# EAGLE design controlboard (EAGLE 9.2.2)
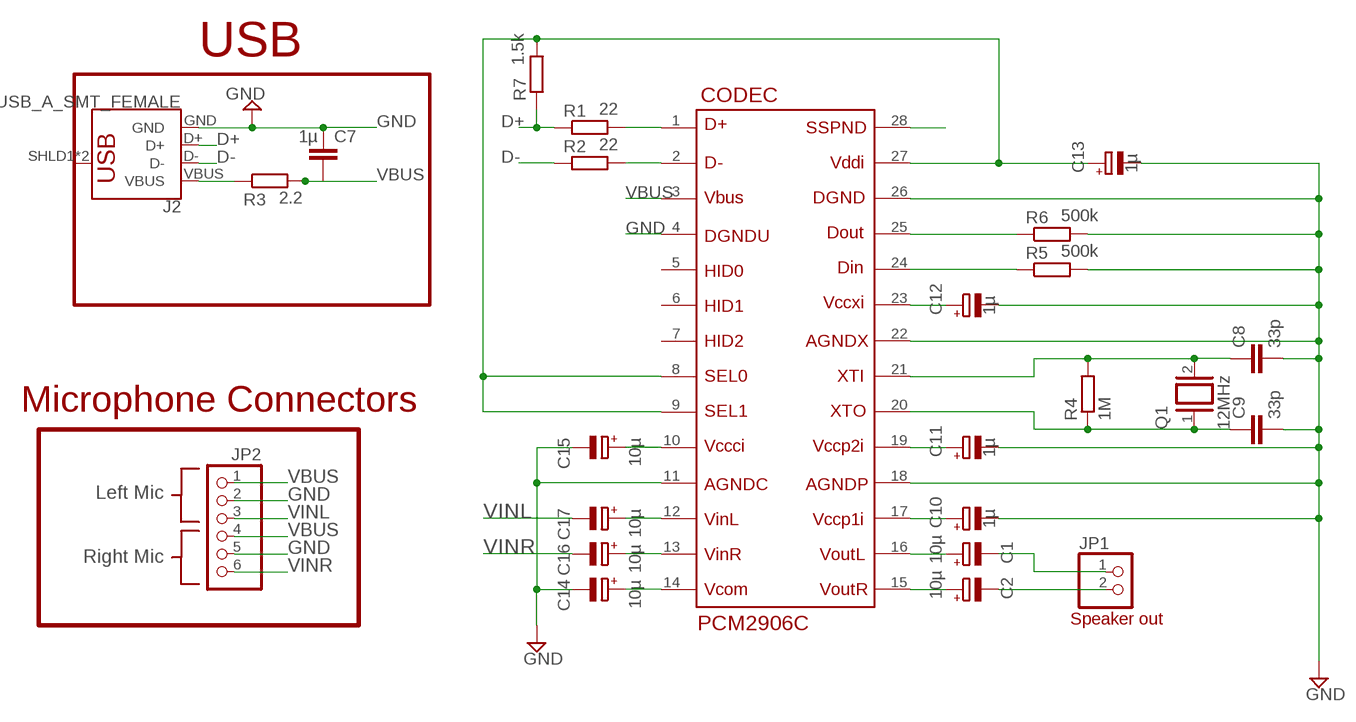
[diagram p0: schematic, sheet 1]

## Parts
C1  10µ  CPOL-EU153CLV-0807  [153CLV-0807]
C2  10µ  CPOL-EU153CLV-0807  [153CLV-0807]
C7  1µ  C-EUC0805  [C0805]
C8  33p  C-EUC0805  [C0805]
C9  33p  C-EUC0805  [C0805]
C10  1µ  CPOL-EU153CLV-0807  [153CLV-0807]
C11  1µ  CPOL-EU153CLV-0807  [153CLV-0807]
C12  1µ  CPOL-EU153CLV-0807  [153CLV-0807]
C13  1µ  CPOL-EU153CLV-0807  [153CLV-0807]
C14  10µ  CPOL-EU153CLV-0807  [153CLV-0807]
C15  10µ  CPOL-EU153CLV-0807  [153CLV-0807]
C16  10µ  CPOL-EU153CLV-0807  [153CLV-0807]
C17  10µ  CPOL-EU153CLV-0807  [153CLV-0807]
CODEC  PCM2906C  [SOP65P780X200-28N]
J2  USB_A_SMT_FEMALE  [USB-A-S-SILK-FEMALE]
JP1  PINHD-1X2  [1X02]
JP2  PINHD-1X6  [1X06]
Q1  12MHz  XTAL/S  [QS]
R1  22  R-EU_R0805  [R0805]
R2  22  R-EU_R0805  [R0805]
R3  2.2  R-EU_R0805  [R0805]
R4  1M  R-EU_R0805  [R0805]
R5  500k  R-EU_R0805  [R0805]
R6  500k  R-EU_R0805  [R0805]
R7  1.5k  R-EU_R0805  [R0805]

## Nets
D+: J2.D+ R1.1 R7.1
D-: J2.D- R2.1
GND: C7.1 C8.2 C9.2 C10.- C11.- C12.- C13.- C14.- C15.- CODEC.4 CODEC.11 CODEC.18 CODEC.22 CODEC.26 J2.GND JP2.2 JP2.5 R5.2 R6.2
N$1: CODEC.1 R1.2
N$2: CODEC.2 R2.2
N$3: J2.VBUS R3.1
N$4: C11.+ CODEC.19
N$5: C9.1 CODEC.20 Q1.1 R4.1
N$6: C8.1 CODEC.21 Q1.2 R4.2
N$7: C10.+ CODEC.17
N$8: C12.+ CODEC.23
N$9: CODEC.25 R6.1
N$10: CODEC.24 R5.1
N$11: C13.+ CODEC.8 CODEC.9 CODEC.27 R7.2
N$12: C15.+ CODEC.10
N$13: C14.+ CODEC.14
N$14: CODEC.28
N$15: C1.+ CODEC.16
N$16: C2.+ CODEC.15
N$17: C17.+ CODEC.12
N$18: C16.+ CODEC.13
N$19: C1.- JP1.1
N$20: C2.- JP1.2
VBUS: C7.2 CODEC.3 JP2.1 JP2.4 R3.2
VINL: C17.- JP2.3
VINR: C16.- JP2.6
Unconnected: CODEC.5 CODEC.6 CODEC.7 J2.SHLD1(SHIELD) J2.SHLD2(SHIELD)

## Notes on the sheet
- USB
- Microphone Connectors
- Left Mic
- Right Mic
- Speaker out

## Library data of the parts
C1 C2 C10-C17 = resistor:CPOL-EU: POLARIZED CAPACITOR, European symbol
C7-C9 = rcl:C-EU: CAPACITOR, European symbol; SPICEPREFIX: C
CODEC = PCM2906C_custom:PCM2906C
J2 = SparkFun-Connectors:USB_A: USB-A Connector Male and female variants, as well as PTH and SMT variants SparkFun Products: SparkFun XBee Explorer Dongle <https://www.sparkfun.com/products/11697> PTH Male SparkFun MicroView-USB Programmer <https://www.sparkfun.com/products/12924> SMT Male SparkFun USB Type A Female Breakout <https://www.sparkfun.com/products/12700> SMT Female; PROD_ID: CONN-09520; SF_ID: PRT-09011
JP1 = pinhead:PINHD-1X2: PIN HEADER
JP2 = pinhead:PINHD-1X6: PIN HEADER
Q1 = special:XTAL/S: CRYSTAL
R1-R7 = rcl:R-EU_: RESISTOR, European symbol; SPICEPREFIX: R

## Board
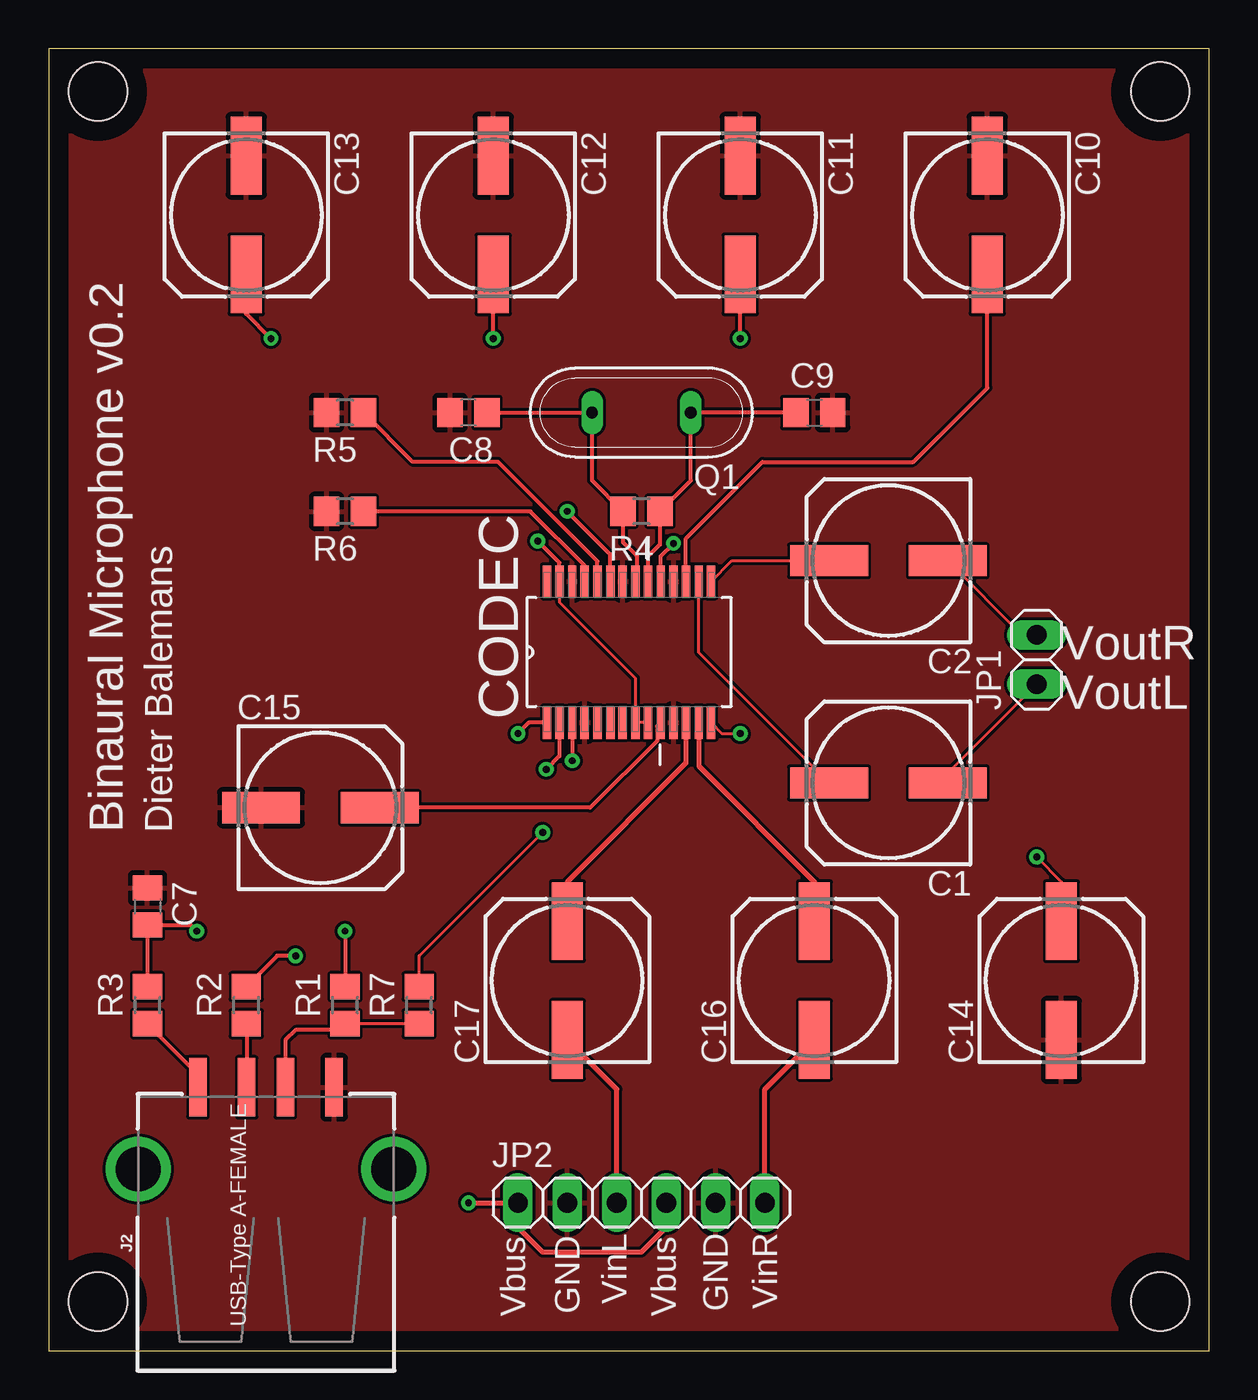
[diagram p1: board, top side]
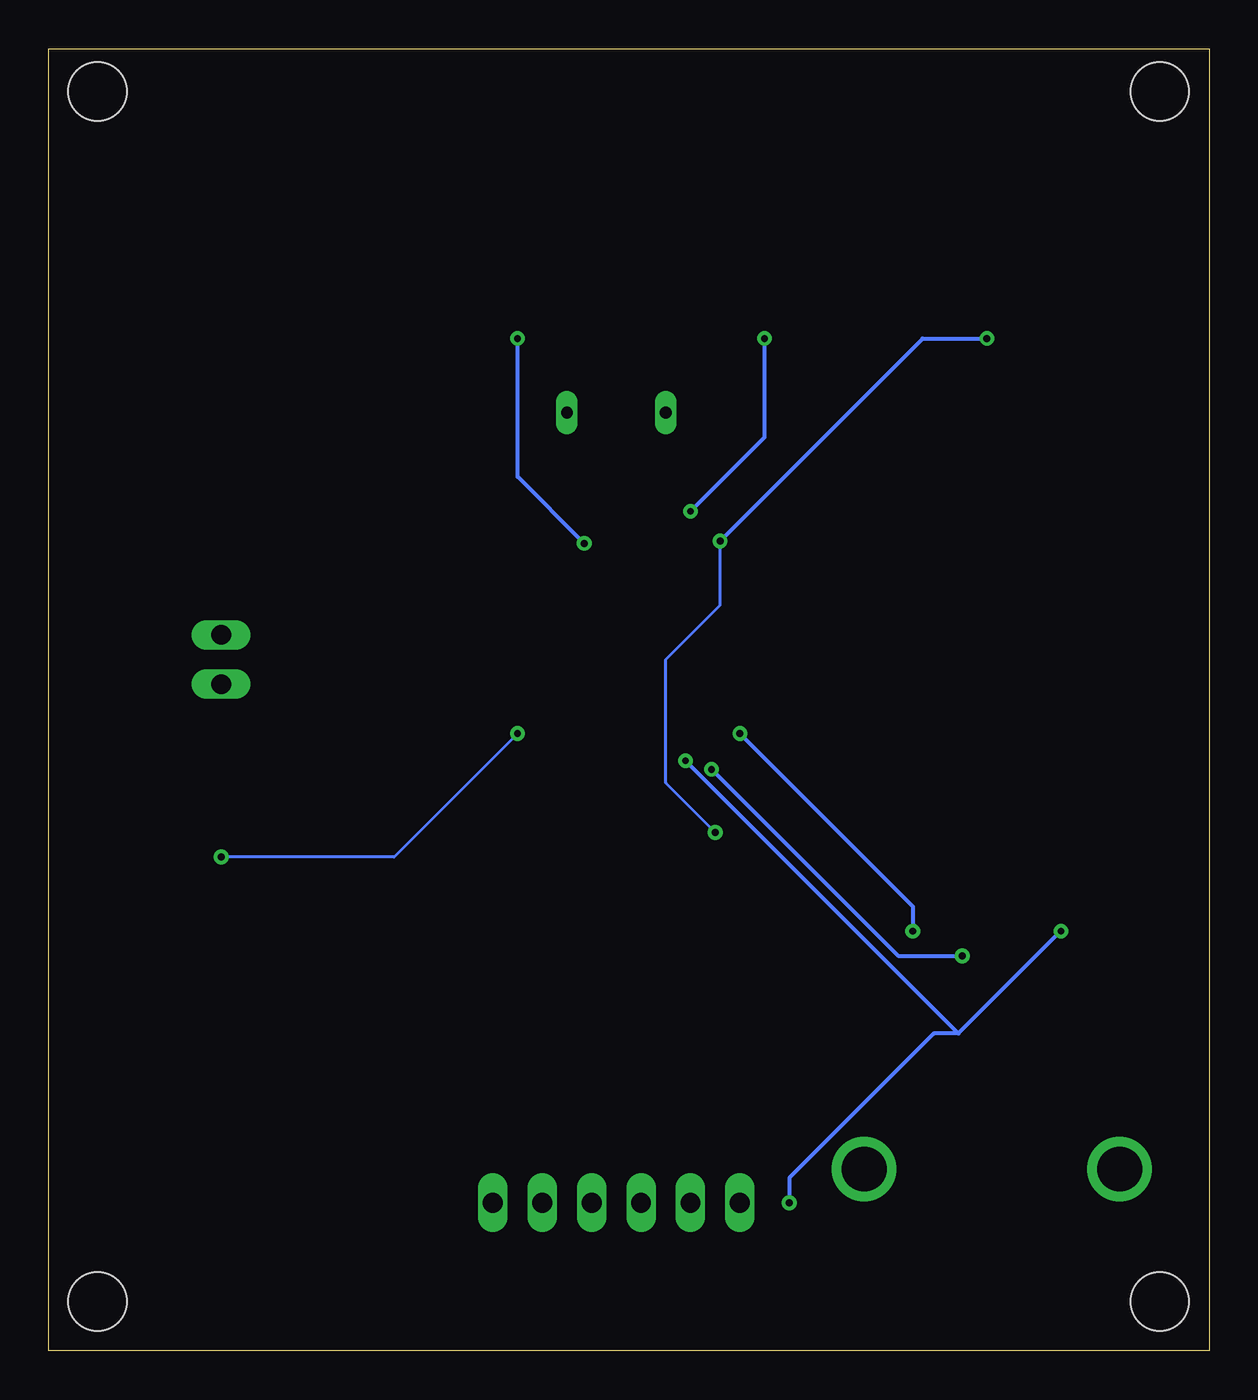
[diagram p2: board, bottom side, seen from below]

Size 59.67 x 66.98 mm. Coordinates in mm from the lower left corner, seen from the top.
Outline: 0,0 59.67,0 59.67,66.98 0,66.98 0,0
Copper layers (1*16): Top 0.035mm / dielectric 1.5mm / Bottom 0.035mm
Design rules "default": minimum track width 6mil, minimum drill 0.35mm, track to track 6mil, track to pad 6mil, pad to pad 6mil, via to via 6mil, smd to smd 6mil, copper to edge 40mil, drill to drill 6mil, minimum pad ring 10mil, minimum via ring 8mil, stop-mask expansion 4mil, vias tented up to drill 0mil, thermal gap 10mil
Holes 3 mm at 2.54,2.54 57.15,2.54 57.15,64.77 2.54,64.77

### Footprints (pad centres in the part's own frame; a part is rotated, then mirrored left to right if it is on the bottom)
153CLV-0807 = smd 4 x 1.6: + 3.05,0; - -3.05,0
C0805 = smd 1.3 x 1.5: 1 -0.95,0; 2 0.95,0
SOP65P780X200-28N = smd 1.651 x 0.432: 1 -3.632,4.216; 2 -3.632,3.581; 3 -3.632,2.921; 4 -3.632,2.286; 5 -3.632,1.626; 6 -3.632,0.965; 7 -3.632,0.33; 8 -3.632,-0.33; 9 -3.632,-0.965; 10 -3.632,-1.626; 11 -3.632,-2.286; 12 -3.632,-2.921; 13 -3.632,-3.581; 14 -3.632,-4.216; 15 3.632,-4.216; 16 3.632,-3.581; 17 3.632,-2.921; 18 3.632,-2.286; 19 3.632,-1.626; 20 3.632,-0.965; 21 3.632,-0.33; 22 3.632,0.33; 23 3.632,0.965; 24 3.632,1.626; 25 3.632,2.286; 26 3.632,2.921; 27 3.632,3.581; 28 3.632,4.216
USB-A-S-SILK-FEMALE = smd 3 x 0.9: D+ 7.212,-1; D- 7.212,1; GND 7.212,-3.5; VBUS 7.212,3.5 | drill 2.311: SHLD1 3,-6.566; SHLD2 3,6.566
1X02 = drill 1.016 long: 1 -1.27,0; 2 1.27,0
1X06 = drill 1.016 long: 1 -6.35,0; 2 -3.81,0; 3 -1.27,0; 4 1.27,0; 5 3.81,0; 6 6.35,0
QS = drill 0.61 long: 1 -2.54,0; 2 2.54,0
R0805 = smd 1.3 x 1.5: 1 -0.95,0; 2 0.95,0

### Placement (x,y rotation side)
C1  43.18,29.21 180 top
C2  43.18,40.64 180 top
C7  5.08,22.86 270 top
C8  21.59,48.26 180 top
C9  39.37,48.26 0 top
C10  48.26,58.42 270 top
C11  35.56,58.42 270 top
C12  22.86,58.42 270 top
C13  10.16,58.42 270 top
C14  52.07,19.05 90 top
C15  13.97,27.94 0 top
C16  39.37,19.05 90 top
C17  26.67,19.05 90 top
CODEC  29.84,35.94 90 top
J2  11.18,6.35 90 top
JP1  50.8,35.56 90 top
JP2  30.48,7.62 0 top
Q1  30.48,48.26 180 top
R1  15.24,17.78 90 top
R2  10.16,17.78 90 top
R3  5.08,17.78 90 top
R4  30.48,43.18 180 top
R5  15.24,48.26 180 top
R6  15.24,43.18 180 top
R7  19.05,17.78 90 top

### Tracks (layer width: path | path; a pad name or v marks a point on that pad's centre or on a via)
D+
  Top 0.152: R7.1 R1.1
  Top 0.203: R1.1 14.92,16.51 12.7,16.51 12.18,15.99 J2.D+
D-
  Top 0.203: R2.1 10.18,16.81 J2.D-
GND
  pour Top: -6.35,-8.89 62.23,-8.89 62.23,73.66 -3.81,73.66 -6.35,-7.62
N$1  (via drill 0.35)
  Top 0.203: CODEC.1 24.69,32.31 v24.13,31.75 | v15.24,21.59 R1.2
  Bottom 0.203: v24.13,31.75 15.24,22.86 v15.24,21.59
N$2  (via drill 0.35)
  Top 0.203: CODEC.2 26.26,30.59 v25.59,29.91 | v12.7,20.32 11.75,20.32 R2.2
  Bottom 0.203: v25.59,29.91 16,20.32 v12.7,20.32
N$3
  Top 0.203: R3.1 7.68,14.23 J2.VBUS
N$4  (via drill 0.35)
  Top 0.203: CODEC.19 31.47,40.87 v32.13,41.53 | v35.56,52.07 C11.+
  Bottom 0.203: v32.13,41.53 35.56,44.96 v35.56,52.07
N$5
  Top 0.203: CODEC.20 30.81,40.84 31.43,41.46 R4.1 33.02,44.77 Q1.1 C9.1
N$6
  Top 0.203: CODEC.21 30.23,39.62 30.23,40.89 29.53,41.59 R4.2 27.94,44.77 Q1.2 C8.1
N$7
  Top 0.203: CODEC.17 32.77,41.78 36.7,45.72 44.45,45.72 48.26,49.53 C10.+
N$8  (via drill 0.35)
  Top 0.203: CODEC.23 28.88,40.97 v26.67,43.18 | v22.86,52.07 C12.+
  Bottom 0.203: v26.67,43.18 22.86,46.99 v22.86,52.07
N$9
  Top 0.203: CODEC.25 27.56,40.39 24.77,43.18 R6.1
N$10
  Top 0.203: CODEC.24 28.22,40.62 23.11,45.72 18.73,45.72 R5.1
N$11  (via drill 0.35)
  Top 0.152: R7.2 19.05,20.32 v25.4,26.67 | CODEC.9 CODEC.8 30.18,34.59 26.29,38.48 26.29,39.55 CODEC.27
  Top 0.203: CODEC.27 26.26,40.54 v25.15,41.66 | v11.43,52.07 10.16,53.34 C13.+
  Bottom 0.152: v25.4,26.67 27.94,29.21 27.94,35.56 25.15,38.35 v25.15,41.66
  Bottom 0.203: v25.15,41.66 14.73,52.07 v11.43,52.07
N$12
  Top 0.203: CODEC.10 31.28,32.12 31.28,31.38 27.84,27.94 C15.+
N$13  (via drill 0.35)
  Top 0.152: CODEC.14 34.62,31.75 v35.56,31.75 | v50.8,25.4 52.07,24.13 C14.+
  Bottom 0.152: v35.56,31.75 41.91,25.4 v50.8,25.4
N$15
  Top 0.152: C1.+ 33.43,35.91 CODEC.16
N$16
  Top 0.152: CODEC.15 35.13,40.64 C2.+
N$17
  Top 0.254: CODEC.12 32.77,30.23 26.67,24.13 C17.+
N$18
  Top 0.254: CODEC.13 33.43,30.07 39.37,24.13 C16.+
N$19
  Top 0.152: JP1.1 46.23,29.72 C1.-
N$20
  Top 0.152: C2.- 50.04,36.83 JP1.2
VBUS  (via drill 0.35)
  Top 0.203: v7.62,21.59 7.3,21.91 C7.2 R3.2 | CODEC.3 v26.92,30.35
  Top 0.254: JP2.4 31.75,6.35 30.48,5.08 25.4,5.08 24.13,6.35 JP2.1 | v21.59,7.62 JP2.1 | JP2.1 24.13,8.89
  Bottom 0.203: v7.62,21.59 12.89,16.32 | v26.92,30.35 12.89,16.32 | 12.89,16.32 14.16,16.32 21.59,8.89 v21.59,7.62
VINL
  Top 0.254: C17.- 29.21,13.46 JP2.3
VINR
  Top 0.254: C16.- 36.83,13.46 JP2.6

### Text on the board
tNames: VoutR | VoutL | Binaural Microphone v0.2 | Dieter Balemans | Vbus | GND | VinL | Vbus | GND | VinR | USB-Type A-FEMALE